# EAGLE schematic domino4_IPP (EAGLE 9.6.2)
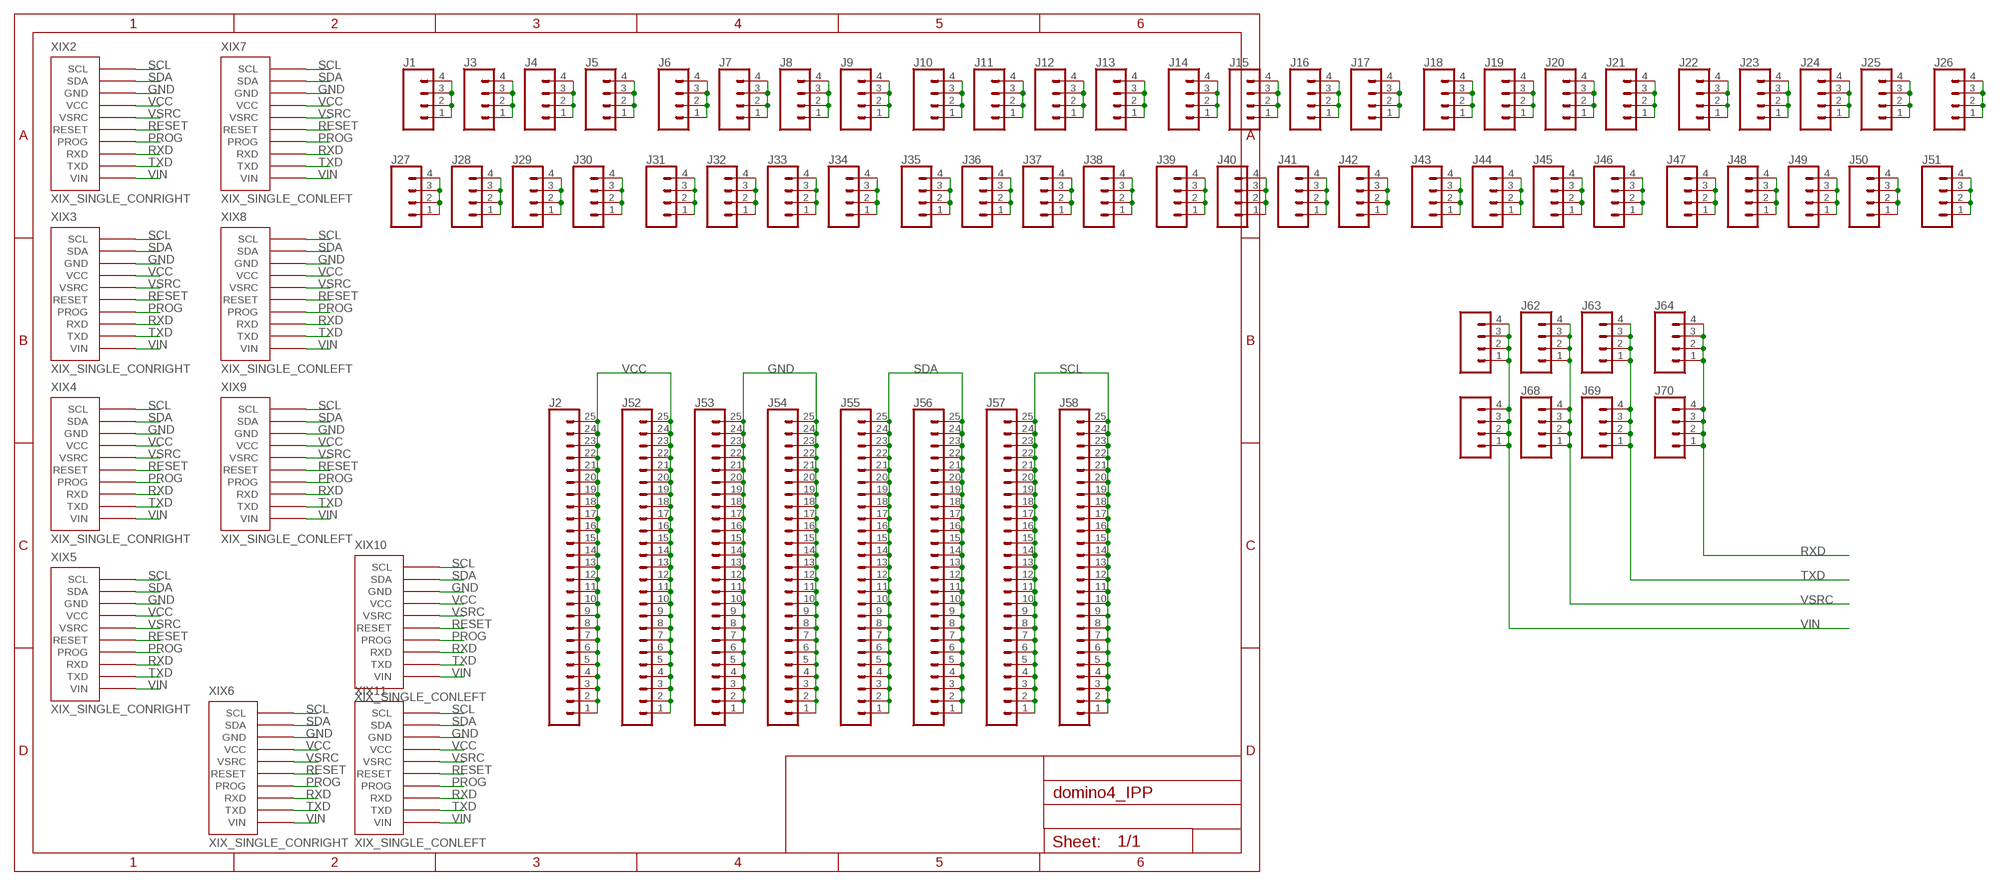
[diagram p0: schematic, sheet 1]

## Parts
J1  CONN_04PTH  [1X04]
J2  CONN_25  [1X25]
J3  CONN_04PTH  [1X04]
J4  CONN_04PTH  [1X04]
J5  CONN_04PTH  [1X04]
J6  CONN_04PTH  [1X04]
J7  CONN_04PTH  [1X04]
J8  CONN_04PTH  [1X04]
J9  CONN_04PTH  [1X04]
J10  CONN_04PTH  [1X04]
J11  CONN_04PTH  [1X04]
J12  CONN_04PTH  [1X04]
J13  CONN_04PTH  [1X04]
J14  CONN_04PTH  [1X04]
J15  CONN_04PTH  [1X04]
J16  CONN_04PTH  [1X04]
J17  CONN_04PTH  [1X04]
J18  CONN_04PTH  [1X04]
J19  CONN_04PTH  [1X04]
J20  CONN_04PTH  [1X04]
J21  CONN_04PTH  [1X04]
J22  CONN_04PTH  [1X04]
J23  CONN_04PTH  [1X04]
J24  CONN_04PTH  [1X04]
J25  CONN_04PTH  [1X04]
J26  CONN_04PTH  [1X04]
J27  CONN_04PTH  [1X04]
J28  CONN_04PTH  [1X04]
J29  CONN_04PTH  [1X04]
J30  CONN_04PTH  [1X04]
J31  CONN_04PTH  [1X04]
J32  CONN_04PTH  [1X04]
J33  CONN_04PTH  [1X04]
J34  CONN_04PTH  [1X04]
J35  CONN_04PTH  [1X04]
J36  CONN_04PTH  [1X04]
J37  CONN_04PTH  [1X04]
J38  CONN_04PTH  [1X04]
J39  CONN_04PTH  [1X04]
J40  CONN_04PTH  [1X04]
J41  CONN_04PTH  [1X04]
J42  CONN_04PTH  [1X04]
J43  CONN_04PTH  [1X04]
J44  CONN_04PTH  [1X04]
J45  CONN_04PTH  [1X04]
J46  CONN_04PTH  [1X04]
J47  CONN_04PTH  [1X04]
J48  CONN_04PTH  [1X04]
J49  CONN_04PTH  [1X04]
J50  CONN_04PTH  [1X04]
J51  CONN_04PTH  [1X04]
J52  CONN_25  [1X25]
J53  CONN_25  [1X25]
J54  CONN_25  [1X25]
J55  CONN_25  [1X25]
J56  CONN_25  [1X25]
J57  CONN_25  [1X25]
J58  CONN_25  [1X25]
J61  CONN_04PTH  [1X04]
J62  CONN_04PTH  [1X04]
J63  CONN_04PTH  [1X04]
J64  CONN_04PTH  [1X04]
J67  CONN_04PTH  [1X04]
J68  CONN_04PTH  [1X04]
J69  CONN_04PTH  [1X04]
J70  CONN_04PTH  [1X04]
XIX2  XIX_SINGLE_CONRIGHT  [XIX_SINGLE_CON_RIGHT]
XIX3  XIX_SINGLE_CONRIGHT  [XIX_SINGLE_CON_RIGHT]
XIX4  XIX_SINGLE_CONRIGHT  [XIX_SINGLE_CON_RIGHT]
XIX5  XIX_SINGLE_CONRIGHT  [XIX_SINGLE_CON_RIGHT]
XIX6  XIX_SINGLE_CONRIGHT  [XIX_SINGLE_CON_RIGHT]
XIX7  XIX_SINGLE_CONLEFT  [XIX_SINGLE_CON_LEFT]
XIX8  XIX_SINGLE_CONLEFT  [XIX_SINGLE_CON_LEFT]
XIX9  XIX_SINGLE_CONLEFT  [XIX_SINGLE_CON_LEFT]
XIX10  XIX_SINGLE_CONLEFT  [XIX_SINGLE_CON_LEFT]
XIX11  XIX_SINGLE_CONLEFT  [XIX_SINGLE_CON_LEFT]

## Nets
GND [pwr]: J53.1 J53.2 J53.3 J53.4 J53.5 J53.6 J53.7 J53.8 J53.9 J53.10 J53.11 J53.12 J53.13 J53.14 J53.15 J53.16 J53.17 J53.18 J53.19 J53.20 J53.21 J53.22 J53.23 J53.24 J53.25 J54.1 J54.2 J54.3 J54.4 J54.5 J54.6 J54.7 J54.8 J54.9 J54.10 J54.11 J54.12 J54.13 J54.14 J54.15 J54.16 J54.17 J54.18 J54.19 J54.20 J54.21 J54.22 J54.23 J54.24 J54.25 XIX2.GND@4(GND) XIX3.GND@4(GND) XIX4.GND@4(GND) XIX5.GND@4(GND) XIX6.GND@4(GND) XIX7.GND@1(GND) XIX8.GND@1(GND) XIX9.GND@1(GND) XIX10.GND@1(GND) XIX11.GND@1(GND)
N$1: J1.1 J1.2 J1.3 J1.4
N$3: J3.1 J3.2 J3.3 J3.4
N$4: J4.1 J4.2 J4.3 J4.4
N$5: J5.1 J5.2 J5.3 J5.4
N$6: J6.1 J6.2 J6.3 J6.4
N$7: J7.1 J7.2 J7.3 J7.4
N$8: J8.1 J8.2 J8.3 J8.4
N$9: J9.1 J9.2 J9.3 J9.4
N$10: J10.1 J10.2 J10.3 J10.4
N$11: J11.1 J11.2 J11.3 J11.4
N$12: J12.1 J12.2 J12.3 J12.4
N$13: J13.1 J13.2 J13.3 J13.4
N$14: J14.1 J14.2 J14.3 J14.4
N$15: J15.1 J15.2 J15.3 J15.4
N$16: J16.1 J16.2 J16.3 J16.4
N$17: J17.1 J17.2 J17.3 J17.4
N$18: J18.1 J18.2 J18.3 J18.4
N$19: J19.1 J19.2 J19.3 J19.4
N$20: J20.1 J20.2 J20.3 J20.4
N$21: J21.1 J21.2 J21.3 J21.4
N$22: J22.1 J22.2 J22.3 J22.4
N$23: J23.1 J23.2 J23.3 J23.4
N$24: J24.1 J24.2 J24.3 J24.4
N$25: J25.1 J25.2 J25.3 J25.4
N$26: J26.1 J26.2 J26.3 J26.4
N$27: J27.1 J27.2 J27.3 J27.4
N$28: J28.1 J28.2 J28.3 J28.4
N$29: J29.1 J29.2 J29.3 J29.4
N$30: J30.1 J30.2 J30.3 J30.4
N$31: J31.1 J31.2 J31.3 J31.4
N$32: J32.1 J32.2 J32.3 J32.4
N$33: J33.1 J33.2 J33.3 J33.4
N$34: J34.1 J34.2 J34.3 J34.4
N$35: J35.1 J35.2 J35.3 J35.4
N$36: J36.1 J36.2 J36.3 J36.4
N$37: J37.1 J37.2 J37.3 J37.4
N$38: J38.1 J38.2 J38.3 J38.4
N$39: J39.1 J39.2 J39.3 J39.4
N$40: J40.1 J40.2 J40.3 J40.4
N$41: J41.1 J41.2 J41.3 J41.4
N$42: J42.1 J42.2 J42.3 J42.4
N$43: J43.1 J43.2 J43.3 J43.4
N$44: J44.1 J44.2 J44.3 J44.4
N$45: J45.1 J45.2 J45.3 J45.4
N$46: J46.1 J46.2 J46.3 J46.4
N$47: J47.1 J47.2 J47.3 J47.4
N$48: J48.1 J48.2 J48.3 J48.4
N$49: J49.1 J49.2 J49.3 J49.4
N$50: J50.1 J50.2 J50.3 J50.4
N$51: J51.1 J51.2 J51.3 J51.4
PROG: XIX2.PROG@8(PROG) XIX3.PROG@8(PROG) XIX4.PROG@8(PROG) XIX5.PROG@8(PROG) XIX6.PROG@8(PROG) XIX7.PROG@2(PROG) XIX8.PROG@2(PROG) XIX9.PROG@2(PROG) XIX10.PROG@2(PROG) XIX11.PROG@2(PROG)
RESET: XIX2.RESET@8(RESET) XIX3.RESET@8(RESET) XIX4.RESET@8(RESET) XIX5.RESET@8(RESET) XIX6.RESET@8(RESET) XIX7.RESET@2(RESET) XIX8.RESET@2(RESET) XIX9.RESET@2(RESET) XIX10.RESET@2(RESET) XIX11.RESET@2(RESET)
RXD: J64.1 J64.2 J64.3 J64.4 J70.1 J70.2 J70.3 J70.4 XIX2.RXD@8(RXD) XIX3.RXD@8(RXD) XIX4.RXD@8(RXD) XIX5.RXD@8(RXD) XIX6.RXD@8(RXD) XIX7.RXD@2(RXD) XIX8.RXD@2(RXD) XIX9.RXD@2(RXD) XIX10.RXD@2(RXD) XIX11.RXD@2(RXD)
SCL: J57.1 J57.2 J57.3 J57.4 J57.5 J57.6 J57.7 J57.8 J57.9 J57.10 J57.11 J57.12 J57.13 J57.14 J57.15 J57.16 J57.17 J57.18 J57.19 J57.20 J57.21 J57.22 J57.23 J57.24 J57.25 J58.1 J58.2 J58.3 J58.4 J58.5 J58.6 J58.7 J58.8 J58.9 J58.10 J58.11 J58.12 J58.13 J58.14 J58.15 J58.16 J58.17 J58.18 J58.19 J58.20 J58.21 J58.22 J58.23 J58.24 J58.25 XIX2.SCL@4(SCL) XIX3.SCL@4(SCL) XIX4.SCL@4(SCL) XIX5.SCL@4(SCL) XIX6.SCL@4(SCL) XIX7.SCL@1(SCL) XIX8.SCL@1(SCL) XIX9.SCL@1(SCL) XIX10.SCL@1(SCL) XIX11.SCL@1(SCL)
SDA: J55.1 J55.2 J55.3 J55.4 J55.5 J55.6 J55.7 J55.8 J55.9 J55.10 J55.11 J55.12 J55.13 J55.14 J55.15 J55.16 J55.17 J55.18 J55.19 J55.20 J55.21 J55.22 J55.23 J55.24 J55.25 J56.1 J56.2 J56.3 J56.4 J56.5 J56.6 J56.7 J56.8 J56.9 J56.10 J56.11 J56.12 J56.13 J56.14 J56.15 J56.16 J56.17 J56.18 J56.19 J56.20 J56.21 J56.22 J56.23 J56.24 J56.25 XIX2.SDA@4(SDA) XIX3.SDA@4(SDA) XIX4.SDA@4(SDA) XIX5.SDA@4(SDA) XIX6.SDA@4(SDA) XIX7.SDA@1(SDA) XIX8.SDA@1(SDA) XIX9.SDA@1(SDA) XIX10.SDA@1(SDA) XIX11.SDA@1(SDA)
TXD: J63.1 J63.2 J63.3 J63.4 J69.1 J69.2 J69.3 J69.4 XIX2.TXD@8(TXD) XIX3.TXD@8(TXD) XIX4.TXD@8(TXD) XIX5.TXD@8(TXD) XIX6.TXD@8(TXD) XIX7.TXD@2(TXD) XIX8.TXD@2(TXD) XIX9.TXD@2(TXD) XIX10.TXD@2(TXD) XIX11.TXD@2(TXD)
VCC [pwr]: J2.1 J2.2 J2.3 J2.4 J2.5 J2.6 J2.7 J2.8 J2.9 J2.10 J2.11 J2.12 J2.13 J2.14 J2.15 J2.16 J2.17 J2.18 J2.19 J2.20 J2.21 J2.22 J2.23 J2.24 J2.25 J52.1 J52.2 J52.3 J52.4 J52.5 J52.6 J52.7 J52.8 J52.9 J52.10 J52.11 J52.12 J52.13 J52.14 J52.15 J52.16 J52.17 J52.18 J52.19 J52.20 J52.21 J52.22 J52.23 J52.24 J52.25 XIX2.VCC@4(VCC) XIX3.VCC@4(VCC) XIX4.VCC@4(VCC) XIX5.VCC@4(VCC) XIX6.VCC@4(VCC) XIX7.VCC@1(VCC) XIX8.VCC@1(VCC) XIX9.VCC@1(VCC) XIX10.VCC@1(VCC) XIX11.VCC@1(VCC)
VIN [pwr]: J61.1 J61.2 J61.3 J61.4 J67.1 J67.2 J67.3 J67.4 XIX2.VRAW@8(VIN) XIX3.VRAW@8(VIN) XIX4.VRAW@8(VIN) XIX5.VRAW@8(VIN) XIX6.VRAW@8(VIN) XIX7.VRAW@2(VIN) XIX8.VRAW@2(VIN) XIX9.VRAW@2(VIN) XIX10.VRAW@2(VIN) XIX11.VRAW@2(VIN)
VSRC [pwr]: J62.1 J62.2 J62.3 J62.4 J68.1 J68.2 J68.3 J68.4 XIX2.VBAT@4(VSRC) XIX3.VBAT@4(VSRC) XIX4.VBAT@4(VSRC) XIX5.VBAT@4(VSRC) XIX6.VBAT@4(VSRC) XIX7.VBAT@1(VSRC) XIX8.VBAT@1(VSRC) XIX9.VBAT@1(VSRC) XIX10.VBAT@1(VSRC) XIX11.VBAT@1(VSRC)

## Library data of the parts
J1 J3-J51 J61-J64 J67-J70 = SparkFun-Connectors:CONN_04: Multi connection point. Often used as Generic Header-pin footprint for 0.1 inch spaced/style header connections On any of the 0.1 inch spaced packages, you can populate with these: Break Away Headers - Straight <https://www.sparkfun.com/products/116> (PRT-00116) Break Away Male Headers - Right Angle <https://www.sparkfun.com/products/553> (PRT-00553) Female Headers <https://www.sparkfun.com/products/115> (PRT-00115) Break Away Headers - Machine Pin <https://www.sparkfun.com/products/117> (PRT-00117) Break Away Female Headers - Swiss Machine Pin <https://www.sparkfun.com/products/743> (PRT-00743) For SCREWTERMINALS and SPRING TERMINALS visit here: Screw Terimnals on SparkFun.com <https://www.sparkfun.com/search/results?term=Screw+Terminals> (5mm/3.5mm/2.54mm spacing) This device is also useful as a general connection point to wire up your design to another part of your project. Our various solder wires solder well into these plated through hole pads. Hook-Up Wire - Assortment (Stranded, 22 AWG) <https://www.sparkfun.com/products/11375> (PRT-11375) Hook-Up Wire - Assortment (Solid Core, 22 AWG) <https://www.sparkfun.com/products/11367> (PRT-11367) View the entire wire category on our website here <https://www.sparkfun.com/categories/141> Special notes: Molex polarized connector foot print use with SKU : PRT-08231 with associated crimp pins and housings. 1MM SMD Version SKU: PRT-10208; PROD_ID: CONN-09696
J2 J52-J58 = SparkFun-Connectors:CONN_25: Multi connection point. Often used as Generic Header-pin footprint for 0.1 inch spaced/style header connections On any of the 0.1 inch spaced packages, you can populate with these: Break Away Headers - Straight <https://www.sparkfun.com/products/116> (PRT-00116) Break Away Male Headers - Right Angle <https://www.sparkfun.com/products/553> (PRT-00553) Female Headers <https://www.sparkfun.com/products/115> (PRT-00115) Break Away Headers - Machine Pin <https://www.sparkfun.com/products/117> (PRT-00117) Break Away Female Headers - Swiss Machine Pin <https://www.sparkfun.com/products/743> (PRT-00743) For SCREWTERMINALS and SPRING TERMINALS visit here: Screw Terimnals on SparkFun.com <https://www.sparkfun.com/search/results?term=Screw+Terminals> (5mm/3.5mm/2.54mm spacing) This device is also useful as a general connection point to wire up your design to another part of your project. Our various solder wires solder well into these plated through hole pads. Hook-Up Wire - Assortment (Stranded, 22 AWG) <https://www.sparkfun.com/products/11375> (PRT-11375) Hook-Up Wire - Assortment (Solid Core, 22 AWG) <https://www.sparkfun.com/products/11367> (PRT-11367) View the entire wire category on our website here <https://www.sparkfun.com/categories/141> Special notes: Molex polarized connector foot print use with SKU : PRT-08231 with associated crimp pins and housings. 1MM SMD Version SKU: PRT-10208 NOTES ON THE VARIANTS LOCK and LOCK_LONGPADS... This footprint was designed to help hold the alignment of a through-hole component (i.e. 6-pin header) while soldering it into place. You may notice that each hole has been shifted either up or down by 0.005 of an inch from it's more standard position (which is a perfectly straight line). This slight alteration caused the pins (the squares in the middle) to touch the edges of the holes. Because they are alternating, it causes a "brace" to hold the component in place. 0.005 has proven to be the perfect amount of "off-center" position when using our standard breakaway headers. Although looks a little odd when you look at the bare footprint, once you have a header in there, the alteration is very hard to notice. Also,if you push a header all the way into place, it is covered up entirely on the bottom side.
XIX2-XIX11 = XiX-xBUS:XIX_SINGLE_CON

## Net classes
0 default: width 0.152 mm, drill 0.305 mm, clearance 0.152 mm
1 pwr: width 0.254 mm, drill 0.305 mm, clearance 0.152 mm